# Altium schematic sheet mcu.SchDoc: =ProjectName+'_'+Revision+'_'+VariantName
size A3; Date: [Sheet Date]; Author: [Sheet Author]; DocumentNumber: 4; Revision: 0; SheetNumber: 4; SheetTotal: 5
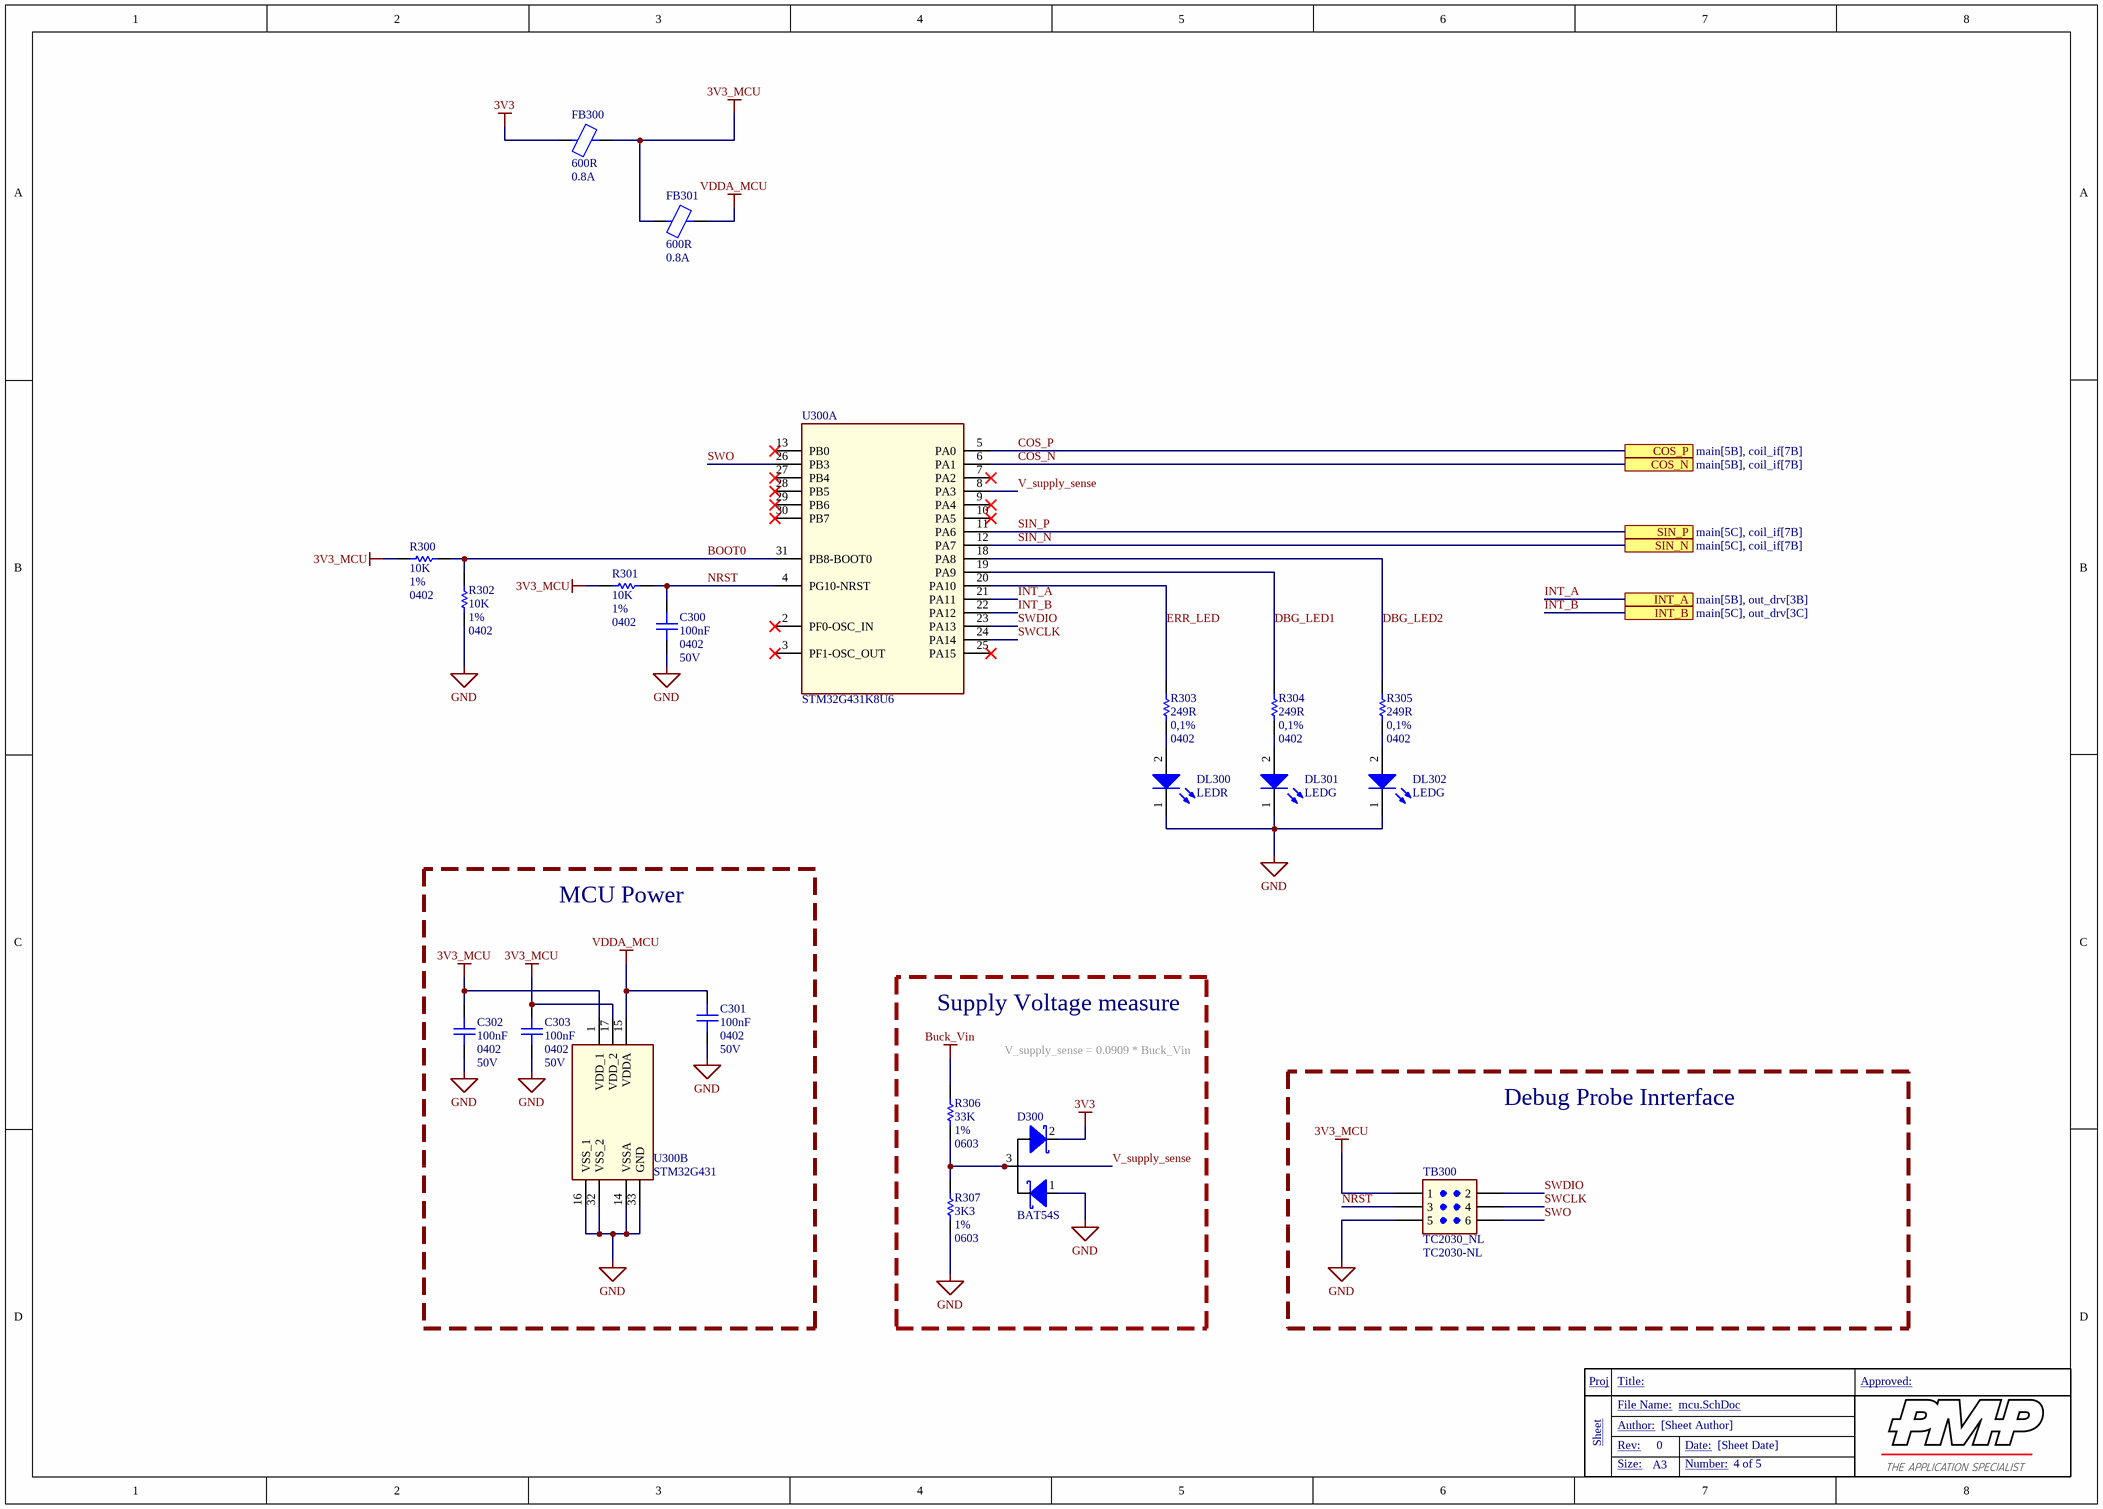
[diagram p0: mcu.SchDoc]

## Parts
C300  Case/Package: 0402  Op Voltage: 50V  [CER0402]  (hidden comment: 100nF)
C301  Case/Package: 0402  Op Voltage: 50V  [CER0402]  (hidden comment: 100nF)
C302  Case/Package: 0402  Op Voltage: 50V  [CER0402]  (hidden comment: 100nF)
C303  Case/Package: 0402  Op Voltage: 50V  [CER0402]  (hidden comment: 100nF)
D300  value BAT54S  [SOT95P230X110-3N]  (hidden comment: Double Schottky Diode, SOT23-3 series)
DL300  value LEDR  [LED SMD 0603]  (hidden comment: Single Color SMD LED)
DL301  value LEDG  [LED SMD 0603]  (hidden comment: Single Color SMD LED)
DL302  value LEDG  [LED SMD 0603]  (hidden comment: Single Color SMD LED)
FB300  Impedence @100MHz: 600R  Rated Current @85°C: 0.8A  [FEB0603]
FB301  Impedence @100MHz: 600R  Rated Current @85°C: 0.8A  [FEB0603]
R300  value 10K  Tolerance: 1%  Case/Package: 0402  [Res0402]  (hidden comment: SMD Resistor)
R301  value 10K  Tolerance: 1%  Case/Package: 0402  [Res0402]  (hidden comment: SMD Resistor)
R302  value 10K  Tolerance: 1%  Case/Package: 0402  [Res0402]  (hidden comment: SMD Resistor)
R303  value 249R  Tolerance: 0,1%  Case/Package: 0402  [Res0402]  (hidden comment: SMD Resistor)
R304  value 249R  Tolerance: 0,1%  Case/Package: 0402  [Res0402]  (hidden comment: SMD Resistor)
R305  value 249R  Tolerance: 0,1%  Case/Package: 0402  [Res0402]  (hidden comment: SMD Resistor)
R306  value 33K  Tolerance: 1%  Case/Package: 0603  [Res0603]  (hidden comment: SMD Resistor)
R307  value 3K3  Tolerance: 1%  Case/Package: 0603  [Res0603]  (hidden comment: SMD Resistor)
TB300  TC2030_NL  value TC2030-NL  [TC2030_NL]
U300  STM32G431K8U6  [QFN50P500X500X60-33N]  (parts A,B of 2)

## Blocks framed on the sheet
MCU Power: C301-C303 U300
Supply Voltage measure: D300 R306 R307
Debug Probe Inrterface: TB300

## Ports
COS_N (see main[5B], coil_if[7B]), COS_P (see main[5B], coil_if[7B]), INT_A (see main[5B], out_drv[3B]), INT_B (see main[5C], out_drv[3C]), SIN_N (see main[5C], coil_if[7B]), SIN_P (see main[5C], coil_if[7B])

## Nets
3V3: D300.2(K2) FB300.1
3V3_MCU: C302.1 C303.1 FB300.2 FB301.1 R300.2 R301.2 TB300.1 U300.1(VDD_1) U300.17(VDD_2)
Buck_Vin: R306.2
GND: C300.2 C301.2 C302.2 C303.2 D300.1(A1) DL300.1(K) DL301.1(K) DL302.1(K) R302.1 R307.1 TB300.5 U300.14(VSSA) U300.16(VSS_1) U300.32(VSS_2) U300.33(GND)
VDDA_MCU: C301.1 FB301.2 U300.15(VDDA)
BOOT0: R300.1 R302.2 U300.31(PB8-BOOT0)
COS_N: U300.6(PA1) ; port COS_N
COS_P: U300.5(PA0) ; port COS_P
DBG_LED1: R304.2 U300.19(PA9)
DBG_LED2: R305.2 U300.18(PA8)
ERR_LED: R303.2 U300.20(PA10)
INT_A: U300.21(PA11) ; port INT_A
INT_B: U300.22(PA12) ; port INT_B
NRST: C300.1 R301.1 TB300.3 U300.4(PG10-NRST)
SIN_N: U300.12(PA7) ; port SIN_N
SIN_P: U300.11(PA6) ; port SIN_P
SWCLK: TB300.4 U300.24(PA14)
SWDIO: TB300.2 U300.23(PA13)
SWO: TB300.6 U300.26(PB3)
V_supply_sense: D300.3(C) R306.1 R307.2 U300.8(PA3)
NetDL300_2: DL300.2(A) R303.1
NetDL301_2: DL301.2(A) R304.1
NetDL302_2: DL302.2(A) R305.1

Not connected (* = marked no-connect by the designer): U300 2(PF0-OSC_IN)* 3(PF1-OSC_OUT)* 7(PA2)* 9(PA4)* 10(PA5)* 13(PB0)* 25(PA15)* 27(PB4)* 28(PB5)* 29(PB6)* 30(PB7)*

## Notes on the sheet
- V_supply_sense = 0.0909 * Buck_Vin
- Proj
- Title:
- Approved:
- Sheet
- File Name:
- Rev:
- Author:
- Date:
- Size:
- A3
- Number:

## Library data of the parts
C300-C303 = GCM155R71H104KE02D: MLCC Automotive, 100nF, 0402, 50V, 10%, X7r; MFG1: MURATA; Min Op# Temp °C: -55; Max Op# temp °C: 125; Qualification: AEC-Q200; MPN1: GCM155R71H104KE02D; Value: 100nF; MFG2: MURATA; MPN2: GCM155R71H104KE37; Tolerance: 10%; Dielectric: X7R; Supplier: Mouser; Supplier Part Number: 81-GCM155R71H104KE2D; Supplier URL: https://www.mouser.it/ProductDetail/Murata-Electronics/GCM155R71H104KE02D?qs=hNud%2FORuBR2sLZsqfoz4Fw%3D%3D; Datasheet URL: https://www.mouser.it/datasheet/2/281/1/GCM155R71H104KE02_01A-3142168.pdf; Technology: Powertrain/Safety for Automotive
D300 = BAT54S: Dual Schottky Diode,  Dual Series, SOT23, 0.2A, 30V; MFG1: NEXPERIA; If (A): 0.2; Type: Dual Series A1K2C; MPN1: BAT54S; MFG2: OnSemi; MPN2: BAT54SLT1G; Vreverse: 30V; Case/Package: SOT323-3 (SC70)
DL300 = SML-D12U8WT86C: LED standard - SMD Red 620nm 63mcd 2.2 V, 20mA, 0603 AECQ-102; MFG1: ROHM; Vf: 2V @4mA; Max Current@ Tmax: 4mA; Power Diss (mW): 54mW; Min Op# Temp °C: -40; Max Op# temp °C: 100; Qualification: AEC-Q101; MPN1: SML-D12U8WT86C; Case/Package: 0603-Top View; Color: red 620nm; Supplier: Mouser; Supplier Part Number: 755-SML-D12U8WT86C; Supplier URL: https://www.mouser.it/ProductDetail/ROHM-Semiconductor/SML-D12U8WT86C?qs=HXFqYaX1Q2wNcb%2FPJz96zg%3D%3D; Datasheet URL: https://fscdn.rohm.com/en/products/databook/datasheet/opto/led/chip_mono/sml-d12u8wt86(c)-e.pdf; Technology: SM
DL301 DL302 = SML-D12P8WT86C: LED standard - SMD Grn 560nm 6.3mcd 2.2 V, 20mA, 0603 AECQ-102; MFG1: ROHM; Vf: 2V @4mA; Max Current@ Tmax: 4mA; Power Diss (mW): 54mW; Min Op# Temp °C: -40; Max Op# temp °C: 100; Qualification: AEC-Q101; MPN1: SML-D12P8WT86C; Case/Package: 0603-Top View; Color: Green 560nm; Supplier: Mouser; Supplier Part Number: 755-SML-D12P8WT86C; Supplier URL: https://www.mouser.it/ProductDetail/ROHM-Semiconductor/SML-D12P8WT86C?qs=HXFqYaX1Q2wFepzn1zWRrg%3D%3D; Datasheet URL: https://fscdn.rohm.com/en/products/databook/datasheet/opto/led/chip_mono/sml-d12p8wt86(c)-e.pdf; Technology: SM
FB300 FB301 = BLM18HE601SH1D: SMD EMI Suppression Ferrite Bead 600R, 0603, For DC Power; MFG1: MURATA; Rated Current @125°C: 0.6A; DCR (mR): 125; Min Op# Temp °C: -55; MPN1: BLM18HE601SH1D; Impedence @1GHz: 600R; Case/Package: 0603; Supplier: Mouser; Supplier Part Number: 81-BLM18HE601SH1D; Supplier URL: https://www.mouser.it/ProductDetail/Murata-Electronics/BLM18HE601SH1D?qs=d0WKAl%252BL4KZJDOgHon8ecQ%3D%3D; Datasheet URL: https://www.murata.com/products/productdata/8796199452702/QNFA9104.pdf?1539737628000; Max Op# temp °C: 125; Technology: AEC-Q200
R300-R302 = CRCW040210K0FKED: Thick Film SM Chip Resistors, 10K, 0402, ±1%, 1/10W; MFG1: VISHAY; Power: 63mW; Temp# Coeffiient (PPM/C): 100; Min Op# Temp °C: -55; Max Op# temp °C: 155; Qualification: AEC-Q200; MPN1: CRCW040210K0FKED; Supplier: Mouser; Supplier Part Number: 71-CRCW0402-10K-E3; Supplier URL: https://www.mouser.it/ProductDetail/Vishay-Dale/CRCW040210K0FKED?qs=rlE3Te1NifyN3e8vvxacSw%3D%3D; Technology: Thick Film
R303-R305 = TNPW0402249RBYEP: Thick Film SM Chip Resistors, 249R, 0402, ±0.1%, 10ppm 1/16W; MFG1: VISHAY; Power: 63mW; Temp# Coeffiient (PPM/C): 10; Min Op# Temp °C: -55; Max Op# temp °C: 155; Qualification: AEC-Q200; MPN1: TNPW0402249RBYEP; Supplier: Mouser; Supplier Part Number: 71-TNPW0402249RBYEP; Supplier URL: https://www.mouser.it/ProductDetail/Vishay-Dale/TNPW0402249RBYEP?qs=iLbezkQI%252Bsgmf6IA3nvojA%3D%3D; Technology: Thick Film
R306 = CRCW060333K0FKEA: Thick Film SM Chip Resistors, 33K, 0603, ±1%, 1/10W; MFG1: VISHAY; Power: 100mW; Temp# Coeffiient (PPM/C): 100; Min Op# Temp °C: -55; Max Op# temp °C: 155; Qualification: AEC-Q200; MPN1: CRCW060333K0FKEA; Supplier: Mouser; Supplier Part Number: 71-CRCW0603-33K-E3; Supplier URL: https://www.mouser.it/ProductDetail/Vishay-Dale/CRCW060333K0FKEA?qs=lRdAfIXKPc%2FlOd6gcmC8oQ%3D%3D; Technology: Thick Film
R307 = CRCW06033K30FKEA: Thick Film SM Chip Resistors, 3K3, 0603, ±1%, 1/10W; MFG1: VISHAY; Power: 100mW; Temp# Coeffiient (PPM/C): 100; Min Op# Temp °C: -55; Max Op# temp °C: 155; Qualification: AEC-Q200; MPN1: CRCW06033K30FKEA; Supplier: Mouser; Supplier Part Number: 71-CRCW0603-3.3K-E3; Supplier URL: https://www.mouser.it/ProductDetail/Vishay-Dale/CRCW06033K30FKEA?qs=1ghF3ZI8kS8fRqapjAj84Q%3D%3D&gad_source=1&gclid=EAIaIQobChMI4J_M0IWohAMVrUNBAh1qNACkEAAYBCAAEgIV-vD_BwE; Technology: Thick Film
TB300 = TC2030-NL: SWDIO pogo pin connector pads; MFG1: TAG_CONNECT; Pitch: 1.27mm; ConnType: Board 2 Wire; MPN1: TC2030-NL; Orientation: Vertical; Terminal Type: Exposed Pads
U300 = STM32G431K8U6: MCU  Arm Cortex-M4 MCU 170 MHz -64 KB Flash; Manufacturer_Name: STMicroelectronics; Geometry.Height: 0.6mm; Mouser Part Number: 511-STM32G431K8U6; Mouser Price/Stock: https://www.mouser.co.uk/ProductDetail/STMicroelectronics/STM32G431K8U6?qs=sPbYRqrBIVmxpguskjGNNg%3D%3D; Manufacturer_Part_Number: STM32G431K8U6; Datasheet Link: https://www.st.com/resource/en/datasheet/stm32g431c6.pdf; MPN1: STM32G431K8U6; Value: STM32G431; MFG1: STMicroelectronics; Case/Package: QFN32